# EAGLE schematic adc_blk (EAGLE 9.5.1)
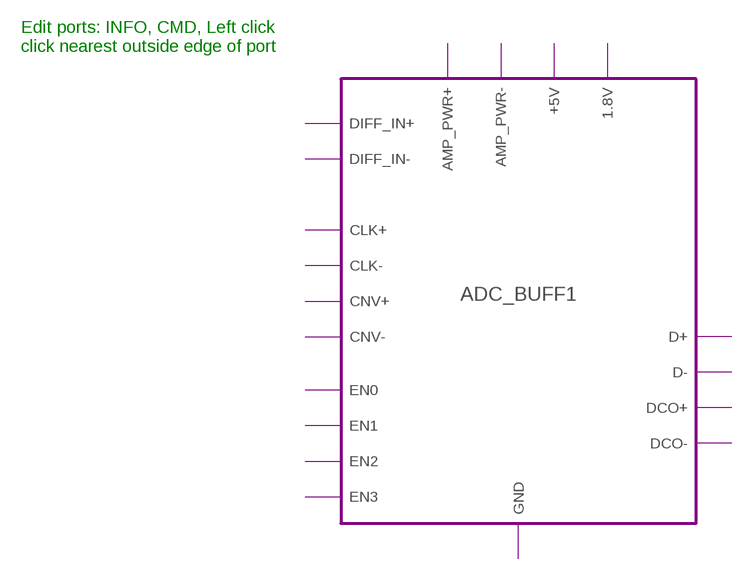
[diagram p0: schematic, sheet 1]

## Module instances
ADC_BUFF1 = ADC_BUFF

## Notes on the sheet
- Edit ports: INFO, CMD, Left click
  click nearest outside edge of port

## Library data of the parts

## Module ADC_BUFF
Ports: AMP_PWR+(pwr) CLK+(out) CLK-(out) CNV+(out) CNV-(out) D+(out) D-(out) DCO+(io) DCO-(out) DIFF_IN+(in) DIFF_IN-(out) +5V(pwr) 1.8V(pwr) EN0(in) EN1(in) EN2(in) EN3(in) GND(pwr) AMP_PWR-(pwr)
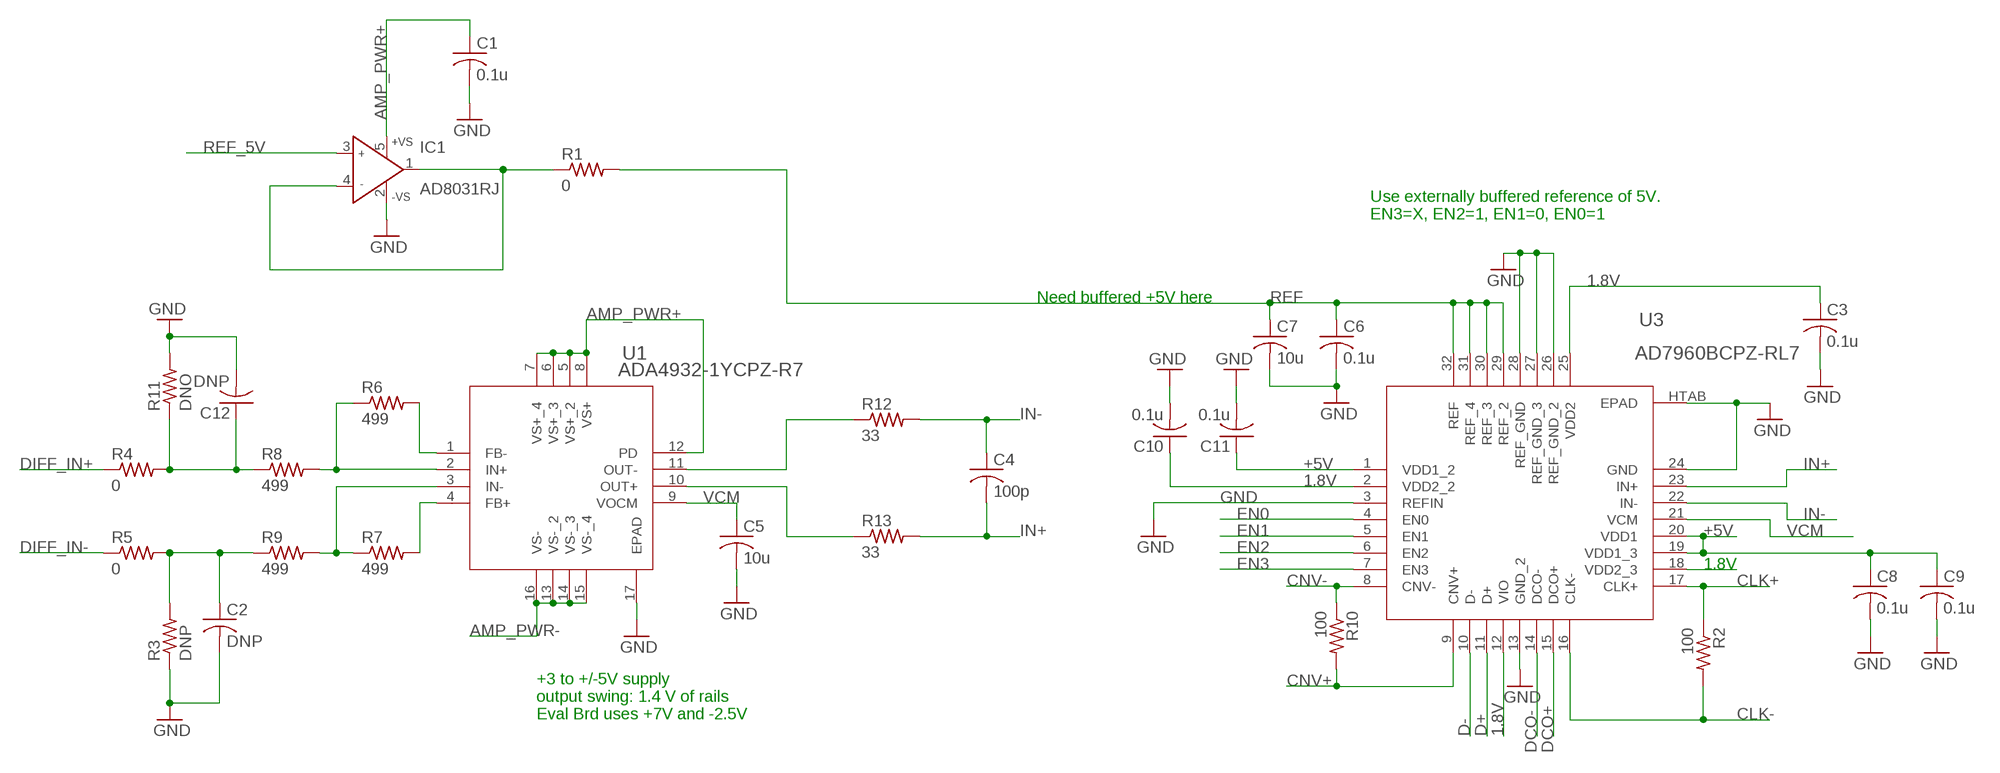
[diagram p1: schematic, module ADC_BUFF, sheet 1]

### Parts
C1  0.1u  C-USC0805  [C0805]
C2  DNP  C-USC0805  [C0805]
C3  0.1u  C-USC0805  [C0805]
C4  100p  C-USC0805  [C0805]
C5  10u  C-USC0805  [C0805]
C6  0.1u  C-USC0805  [C0805]
C7  10u  C-USC0805  [C0805]
C8  0.1u  C-USC0805  [C0805]
C9  0.1u  C-USC0805  [C0805]
C10  0.1u  C-USC0805  [C0805]
C11  0.1u  C-USC0805  [C0805]
C12  DNP  C-USC0805  [C0805]
IC1  AD8031RJ  [SOT23-5]
R1  0  R-US_R0603  [R0603]
R2  100  R-US_R0603  [R0603]
R3  DNP  R-US_R0603  [R0603]
R4  0  R-US_R0603  [R0603]
R5  0  R-US_R0603  [R0603]
R6  499  R-US_R0603  [R0603]
R7  499  R-US_R0603  [R0603]
R8  499  R-US_R0603  [R0603]
R9  499  R-US_R0603  [R0603]
R10  100  R-US_R0603  [R0603]
R11  DNO  R-US_R0603  [R0603]
R12  33  R-US_R0603  [R0603]
R13  33  R-US_R0603  [R0603]
U1  ADA4932-1YCPZ-R7  [CP_16_2]
U3  AD7960BCPZ-RL7  [CP_32_7]

### Nets
1.8V: C3.1 C10.1 U3.2(VDD2_2) U3.12(VIO) U3.25(VDD2)
+5V: C8.1 C9.1 C11.1 U3.1(VDD1_2) U3.19(VDD1_3) U3.20(VDD1)
AMP_PWR+: C1.1 IC1.5(+VS) U1.5(VS+_2) U1.6(VS+_3) U1.7(VS+_4) U1.8(VS+) U1.12(PD)
AMP_PWR-: U1.13(VS-_2) U1.14(VS-_3) U1.15(VS-_4) U1.16(VS-)
CLK+: R2.1 U3.17(CLK+)
CLK-: R2.2 U3.16(CLK-)
CNV+: R10.2 U3.9(CNV+)
CNV-: R10.1 U3.8(CNV-)
D+: U3.11(D+)
D-: U3.10(D-)
DCO+: U3.15(DCO+)
DCO-: U3.14(DCO-)
DIFF_IN+: R4.1
DIFF_IN-: R5.1
EN0: U3.4(EN0)
EN1: U3.5(EN1)
EN2: U3.6(EN2)
EN3: U3.7(EN3)
GND: C1.2 C2.2 C3.2 C5.2 C6.2 C7.2 C8.2 C9.2 C10.2 C11.2 C12.2 IC1.2(-VS) R3.1 R11.2 U1.17(EPAD) U3.3(REFIN) U3.13(GND_2) U3.24(GND) U3.26(REF_GND_2) U3.27(REF_GND_3) U3.28(REF_GND) U3.HTAB(EPAD)
IN+: C4.2 R13.2 U3.23(IN+)
IN-: C4.1 R12.2 U3.22(IN-)
N$1: IC1.1(OUT) IC1.4(IN-) R1.1
N$2: C12.1 R4.2 R8.1 R11.1
N$3: C2.1 R3.2 R5.2 R9.1
N$4: U3.18(VDD2_3)
N$5: R13.1 U1.10(OUT+)
N$6: R12.1 U1.11(OUT-)
N$11: R6.1 R8.2 U1.2(IN+)
N$12: R6.2 U1.1(FB-)
N$13: R7.1 R9.2 U1.3(IN-)
N$14: R7.2 U1.4(FB+)
REF: C6.1 C7.1 R1.2 U3.29(REF_2) U3.30(REF_3) U3.31(REF_4) U3.32(REF)
REF_5V: IC1.3(IN+)
VCM: C5.1 U1.9(VOCM) U3.21(VCM)

### Notes on the sheet
- Use externally buffered reference of 5V. 
  EN3=X, EN2=1, EN1=0, EN0=1
- Need buffered +5V here
- +3 to +/-5V supply
  output swing: 1.4 V of rails
  Eval Brd uses +7V and -2.5V

### Library data of the parts
C1-C12 = rcl:C-US: CAPACITOR, American symbol; SPICEPREFIX: C
IC1 = analog-devices:AD8031: 2.7 V, 800 ?A, 80 MHz Rail-to-Rail I/O Amplifiers Source: http://www.analog.com/static/imported-files/data_sheets/AD8031_8032.pdf; MPN: AD8031ARTZ-REEL7; OC_FARNELL: 1660972; OC_NEWARK: 84R8399
R1-R13 = rcl:R-US_: RESISTOR, American symbol; SPICEPREFIX: R
U1 = open_covg:ADA4932-1YCPZ-R7; MANUFACTURER_PART_NUMBER: ADA49321YCPZR7; VENDOR: Analog Devices Inc
U3 = open_covg:AD7960BCPZ-RL7; MANUFACTURER_PART_NUMBER: AD7960BCPZRL7; VENDOR: Analog Devices Inc